# Altium schematic sheet MAIN.SchDoc
size A4; Author: Khoi Nghiem; Organization: Bach Khoa HN; Address1: Bach Khoa- HBT - HN; Address2: khoi.nt192941; Revision: 1.0Ver; SheetNumber: 1; SheetTotal: 6
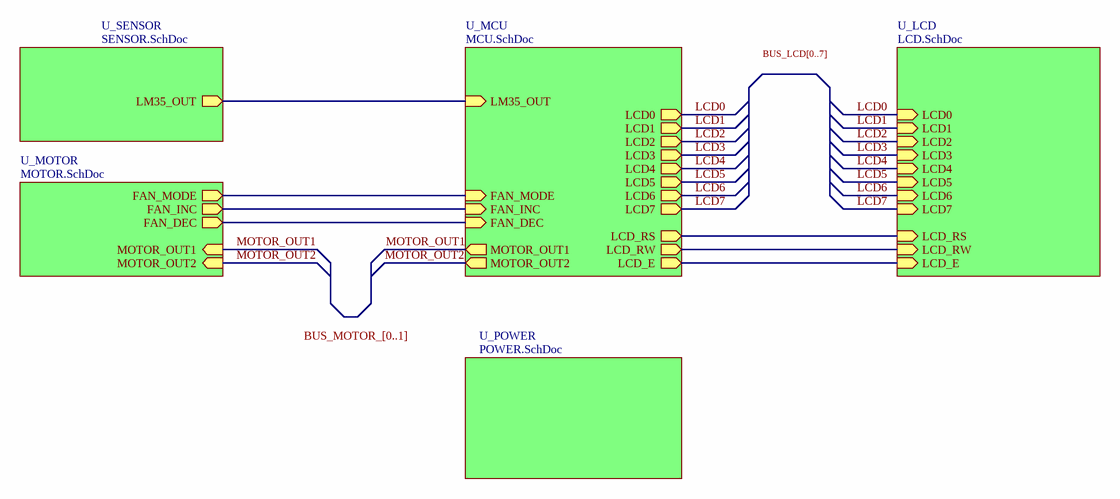
[diagram p0: MAIN.SchDoc]

## Sub-sheets
U_LCD = LCD.SchDoc: LCD0 (in), LCD1 (in), LCD2 (in), LCD3 (in), LCD4 (in), LCD5 (in), LCD6 (in), LCD7 (in), LCD_RS (in), LCD_RW (in), LCD_E (in)
U_MCU = MCU.SchDoc: LM35_OUT (in), MOTOR_OUT1 (out), MOTOR_OUT2 (out), FAN_MODE (in), FAN_INC (in), FAN_DEC (in), LCD0 (out), LCD1 (out), LCD2 (out), LCD3 (out), LCD4 (out), LCD5 (out), LCD6 (out), LCD7 (out), LCD_RS (out), LCD_RW (out), LCD_E (out)
U_MOTOR = MOTOR.SchDoc: MOTOR_OUT1 (in), MOTOR_OUT2 (in), FAN_MODE (out), FAN_INC (out), FAN_DEC (out)
U_POWER = POWER.SchDoc: no entries
U_SENSOR = SENSOR.SchDoc: LM35_OUT (out)

## Nets
LCD0: sheet U_MCU/LCD0, sheet U_LCD/LCD0
LCD1: sheet U_MCU/LCD1, sheet U_LCD/LCD1
LCD2: sheet U_MCU/LCD2, sheet U_LCD/LCD2
LCD3: sheet U_MCU/LCD3, sheet U_LCD/LCD3
LCD4: sheet U_MCU/LCD4, sheet U_LCD/LCD4
LCD5: sheet U_MCU/LCD5, sheet U_LCD/LCD5
LCD6: sheet U_MCU/LCD6, sheet U_LCD/LCD6
LCD7: sheet U_MCU/LCD7, sheet U_LCD/LCD7
MOTOR_OUT1: sheet U_MCU/MOTOR_OUT1, sheet U_MOTOR/MOTOR_OUT1
MOTOR_OUT2: sheet U_MCU/MOTOR_OUT2, sheet U_MOTOR/MOTOR_OUT2
(unnamed): sheet U_MCU/LM35_OUT, sheet U_SENSOR/LM35_OUT
(unnamed): sheet U_MCU/FAN_MODE, sheet U_MOTOR/FAN_MODE
(unnamed): sheet U_MCU/FAN_INC, sheet U_MOTOR/FAN_INC
(unnamed): sheet U_MCU/FAN_DEC, sheet U_MOTOR/FAN_DEC
(unnamed): sheet U_MCU/LCD_RS, sheet U_LCD/LCD_RS
(unnamed): sheet U_MCU/LCD_RW, sheet U_LCD/LCD_RW
(unnamed): sheet U_MCU/LCD_E, sheet U_LCD/LCD_E

## Notes on the sheet
- BUS_LCD[0..7]
- BUS_MOTOR_[0..1]
- Title
- Size:
- Date:
- Author:
- A4
- Time:
- Number:
- Checked:
- Revision:
- Sheet
- Approved:
- of
- File: